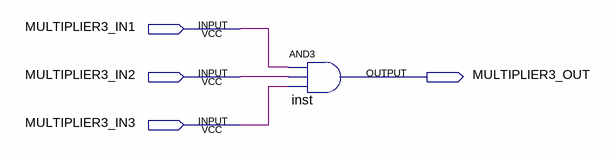
[diagram p0: schematic sheet]
// Quartus schematic MULTIPLIER3.bdf as structural Verilog: 1 symbols, 4 pins
module MULTIPLIER3 (
  input  MULTIPLIER3_IN1,
  input  MULTIPLIER3_IN2,
  input  MULTIPLIER3_IN3,
  output MULTIPLIER3_OUT
);

  and inst (MULTIPLIER3_OUT, MULTIPLIER3_IN1, MULTIPLIER3_IN2, MULTIPLIER3_IN3);
endmodule
